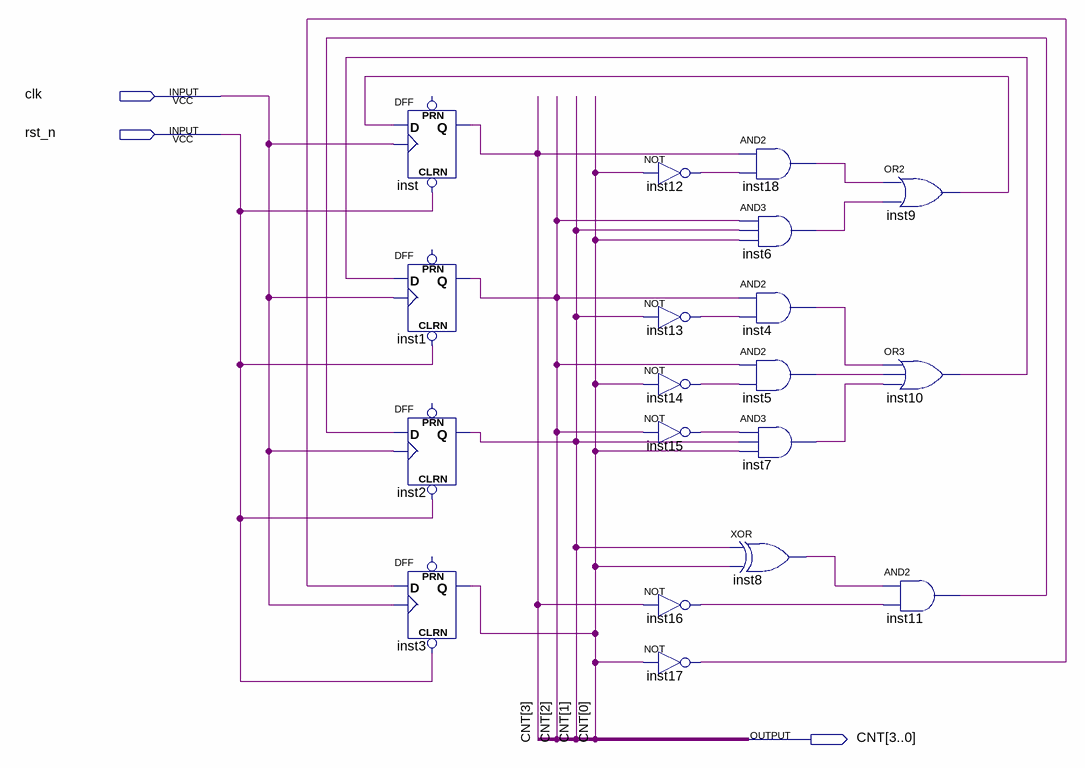
[diagram p0: schematic sheet]
// Quartus schematic counter10.bdf as structural Verilog: 19 symbols, 3 pins
module counter10 (
  input  clk,
  input  rst_n,
  output [3:0] CNT
);

  wire inst4_out, inst5_out, inst6_out, inst7_out, inst8_out, inst9_out, inst10_out, inst11_out, inst12_out,
       inst13_out, inst14_out, inst15_out, inst16_out, inst17_out, inst18_out;

  DFF inst (.CLRN(rst_n), .CLK(clk), .D(inst9_out), .Q(CNT[3]));  // open: PRN
  DFF inst1 (.CLRN(rst_n), .CLK(clk), .D(inst10_out), .Q(CNT[2]));  // open: PRN
  DFF inst2 (.CLRN(rst_n), .CLK(clk), .D(inst11_out), .Q(CNT[1]));  // open: PRN
  DFF inst3 (.CLRN(rst_n), .CLK(clk), .D(inst17_out), .Q(CNT[0]));  // open: PRN
  not inst12 (inst12_out, CNT[0]);
  not inst13 (inst13_out, CNT[1]);
  not inst14 (inst14_out, CNT[0]);
  not inst15 (inst15_out, CNT[2]);
  not inst16 (inst16_out, CNT[3]);
  not inst17 (inst17_out, CNT[0]);
  and inst18 (inst18_out, CNT[3], inst12_out);
  and inst6 (inst6_out, CNT[2], CNT[1], CNT[0]);
  and inst4 (inst4_out, CNT[2], inst13_out);
  and inst5 (inst5_out, CNT[2], inst14_out);
  and inst7 (inst7_out, inst15_out, CNT[1], CNT[0]);
  xor inst8 (inst8_out, CNT[1], CNT[0]);
  or inst9 (inst9_out, inst18_out, inst6_out);
  or inst10 (inst10_out, inst4_out, inst5_out, inst7_out);
  and inst11 (inst11_out, inst8_out, inst16_out);
endmodule
